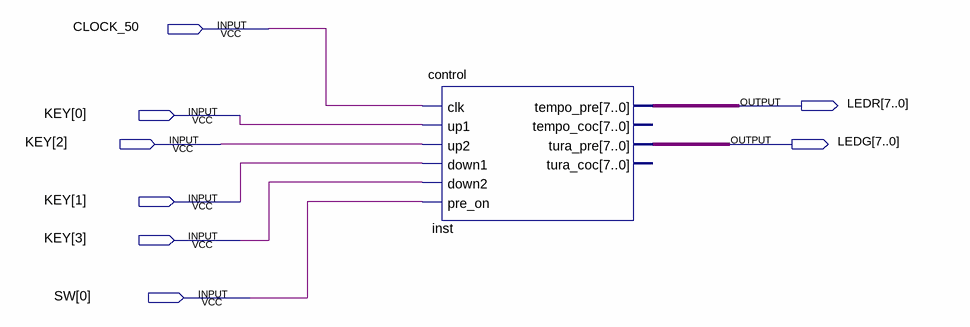
[diagram p0: schematic sheet]
// Quartus schematic Inside_Debounce.bdf as structural Verilog: 1 symbols, 8 pins
module Inside_Debounce (
  input  CLOCK_50,
  input  [3:0] KEY,
  input  [0:0] SW,
  output [7:0] LEDR,
  output [7:0] LEDG
);

  control inst (
    .clk(CLOCK_50), .up1(KEY[0]), .up2(KEY[2]), .down1(KEY[1]), .down2(KEY[3]), .pre_on(SW[0]),
    .tempo_pre(LEDR), .tura_pre(LEDG));  // open: tempo_coc, tura_coc
endmodule
